# EAGLE design freq_count_rpi_hat (EAGLE 9.5.1)
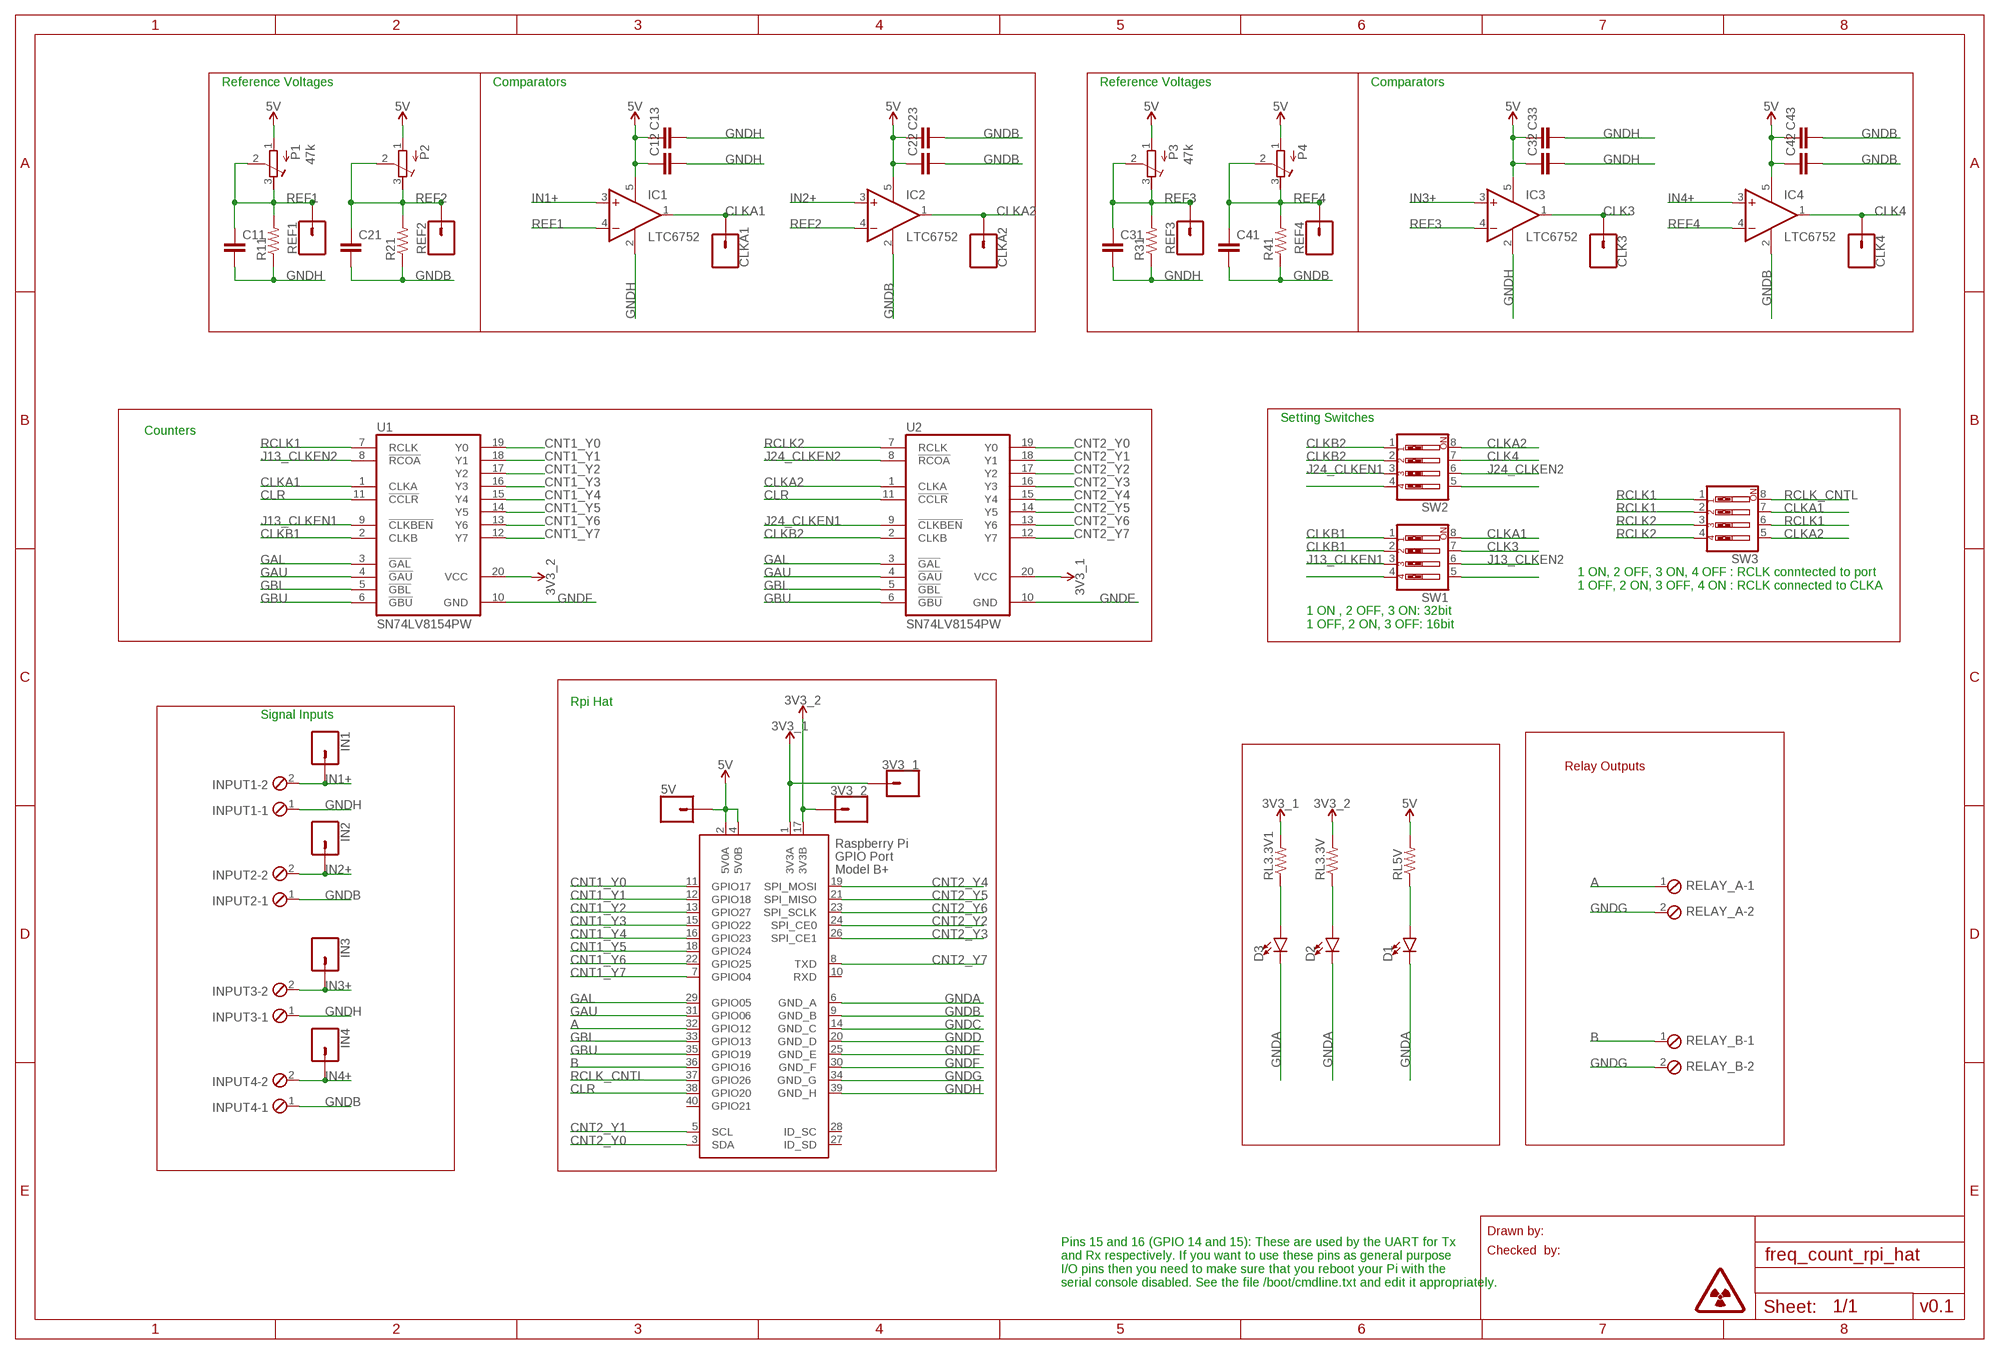
[diagram p0: schematic, sheet 1]

## Parts
3V3_1  CONN_01  [1X01]
3V3_2  CONN_01  [1X01]
5V  CONN_01  [1X01]
C11  C-EUC1206  [C1206]
C12  C-EUC1206  [C1206]
C13  C-EUC1206  [C1206]
C21  C-EUC1206  [C1206]
C22  C-EUC1206  [C1206]
C23  C-EUC1206  [C1206]
C31  C-EUC1206  [C1206]
C32  C-EUC1206  [C1206]
C33  C-EUC1206  [C1206]
C41  C-EUC1206  [C1206]
C42  C-EUC1206  [C1206]
C43  C-EUC1206  [C1206]
CLK3  CONN_01  [1X01]
CLK4  CONN_01  [1X01]
CLKA1  CONN_01  [1X01]
CLKA2  CONN_01  [1X01]
D1  LED1206  [LED-1206]
D2  LED1206  [LED-1206]
D3  LED1206  [LED-1206]
IC1  LTC6752  OPA344N-SOT23  [SOT23-5]
IC2  LTC6752  OPA344N-SOT23  [SOT23-5]
IC3  LTC6752  OPA344N-SOT23  [SOT23-5]
IC4  LTC6752  OPA344N-SOT23  [SOT23-5]
IN1  CONN_01  [1X01]
IN2  CONN_01  [1X01]
IN3  CONN_01  [1X01]
IN4  CONN_01  [1X01]
INPUT1  MPT2  [2POL254]
INPUT2  MPT2  [2POL254]
INPUT3  MPT2  [2POL254]
INPUT4  MPT2  [2POL254]
P1  47k  R-TRIMM3296W  [RTRIM3296W]
P2  R-TRIMM3296W  [RTRIM3296W]
P3  47k  R-TRIMM3296W  [RTRIM3296W]
P4  R-TRIMM3296W  [RTRIM3296W]
R11  R-US_R1206  [R1206]
R21  R-US_R1206  [R1206]
R31  R-US_R1206  [R1206]
R41  R-US_R1206  [R1206]
REF1  CONN_01  [1X01]
REF2  CONN_01  [1X01]
REF3  CONN_01  [1X01]
REF4  CONN_01  [1X01]
RELAY_A  MPT2  [2POL254]
RELAY_B  MPT2  [2POL254]
RL3.3V  R-US_R1206  [R1206]
RL3.3V1  R-US_R1206  [R1206]
RL5V  R-US_R1206  [R1206]
SW1  SW_DIP-4  [EDG-04]
SW2  SW_DIP-4  [EDG-04]
SW3  SW_DIP-4  [EDG-04]
U1  SN74LV8154PW  [TSSOP20]
U2  SN74LV8154PW  [TSSOP20]
X1  RASPI_BOARD_B+#_H  [RASPI_BOARD_B+HAT]

## Nets
5V: 5V.1 C12.1 C13.1 C22.1 C23.1 C32.1 C33.1 C42.1 C43.1 IC1.5(V+) IC2.5(V+) IC3.5(V+) IC4.5(V+) P1.1(A) P2.1(A) P3.1(A) P4.1(A) RL5V.2 X1.2(5V0A) X1.4(5V0B)
A: RELAY_A.1 X1.32(GPIO12)
B: RELAY_B.1 X1.36(GPIO16)
CLK3: CLK3.1 IC3.1(OUT) SW1.7
CLK4: CLK4.1 IC4.1(OUT) SW2.7
CLKA1: CLKA1.1 IC1.1(OUT) SW1.8 SW3.7 U1.1(CLKA)
CLKA2: CLKA2.1 IC2.1(OUT) SW2.8 SW3.5 U2.1(CLKA)
CLKB1: SW1.1 SW1.2 U1.2(CLKB)
CLKB2: SW2.1 SW2.2 U2.2(CLKB)
CLR: U1.11(!CCLR!) U2.11(!CCLR!) X1.38(GPIO20)
CNT1_Y0: U1.19(Y0) X1.11(GPIO17)
CNT1_Y1: U1.18(Y1) X1.12(GPIO18)
CNT1_Y2: U1.17(Y2) X1.13(GPIO27)
CNT1_Y3: U1.16(Y3) X1.15(GPIO22)
CNT1_Y4: U1.15(Y4) X1.16(GPIO23)
CNT1_Y5: U1.14(Y5) X1.18(GPIO24)
CNT1_Y6: U1.13(Y6) X1.22(GPIO25)
CNT1_Y7: U1.12(Y7) X1.7(GPIO04)
CNT2_Y0: U2.19(Y0) X1.3(SDA)
CNT2_Y1: U2.18(Y1) X1.5(SCL)
CNT2_Y2: U2.17(Y2) X1.24(SPI_CE0)
CNT2_Y3: U2.16(Y3) X1.26(SPI_CE1)
CNT2_Y4: U2.15(Y4) X1.19(SPI_MOSI)
CNT2_Y5: U2.14(Y5) X1.21(SPI_MISO)
CNT2_Y6: U2.13(Y6) X1.23(SPI_SCLK)
CNT2_Y7: U2.12(Y7) X1.8(TXD)
GAL: U1.3(!GAL!) U2.3(!GAL!) X1.29(GPIO05)
GAU: U1.4(!GAU!) U2.4(!GAU!) X1.31(GPIO06)
GBL: U1.5(!GBL!) U2.5(!GBL!) X1.33(GPIO13)
GBU: U1.6(!GBU!) U2.6(!GBU!) X1.35(GPIO19)
GNDA: D1.C D2.C D3.C X1.6(GND_A)
GNDB: C21.2 C22.2 C23.2 C41.2 C42.2 C43.2 IC2.2(V-) IC4.2(V-) INPUT2.1 INPUT4.1 R21.1 R41.1 X1.9(GND_B)
GNDC: X1.14(GND_C)
GNDD: X1.20(GND_D)
GNDE: U2.10(GND) X1.25(GND_E)
GNDF: U1.10(GND) X1.30(GND_F)
GNDG: RELAY_A.2 RELAY_B.2 X1.34(GND_G)
GNDH: C11.2 C12.2 C13.2 C31.2 C32.2 C33.2 IC1.2(V-) IC3.2(V-) INPUT1.1 INPUT3.1 R11.1 R31.1 X1.39(GND_H)
IN1+: IC1.3(+IN) IN1.1 INPUT1.2
IN2+: IC2.3(+IN) IN2.1 INPUT2.2
IN3+: IC3.3(+IN) IN3.1 INPUT3.2
IN4+: IC4.3(+IN) IN4.1 INPUT4.2
J13_CLKEN1: SW1.3 U1.9(!CLKBEN!)
J13_CLKEN2: SW1.6 U1.8(!RCOA!)
J24_CLKEN1: SW2.3 U2.9(!CLKBEN!)
J24_CLKEN2: SW2.6 U2.8(!RCOA!)
N$1: D1.A RL5V.1
N$2: D2.A RL3.3V.1
N$3: D3.A RL3.3V1.1
N$4: SW1.4
N$5: SW2.4
N$9: SW2.5
N$11: SW1.5
RCLK1: SW3.1 SW3.2 SW3.6 U1.7(RCLK)
RCLK2: SW3.3 SW3.4 U2.7(RCLK)
RCLK_CNTL: SW3.8 X1.37(GPIO26)
REF1: C11.1 IC1.4(-IN) P1.2(S) P1.3(E) R11.2 REF1.1
REF2: C21.1 IC2.4(-IN) P2.2(S) P2.3(E) R21.2 REF2.1
REF3: C31.1 IC3.4(-IN) P3.2(S) P3.3(E) R31.2 REF3.1
REF4: C41.1 IC4.4(-IN) P4.2(S) P4.3(E) R41.2 REF4.1
VCC_1: 3V3_1.1 RL3.3V1.2 U2.20(VCC) X1.1(3V3A) ; supply symbol labelled 3V3_1
VCC_2: 3V3_2.1 RL3.3V.2 U1.20(VCC) X1.17(3V3B) ; supply symbol labelled 3V3_2
Unconnected: X1.10(RXD) X1.27(ID_SD) X1.28(ID_SC) X1.40(GPIO21)

## Notes on the sheet
- Reference Voltages | Comparators | Reference Voltages | Comparators
- Setting Switches
- Counters
- 1 ON, 2 OFF, 3 ON, 4 OFF : RCLK conntected to port
  1 OFF, 2 ON, 3 OFF, 4 ON : RCLK connected to CLKA
- 1 ON , 2 OFF, 3 ON: 32bit
  1 OFF, 2 ON, 3 OFF: 16bit
- Rpi Hat
- Signal Inputs
- Relay Outputs
- Drawn by:
- Checked  by:
- Pins 15 and 16 (GPIO 14 and 15): These are used by the UART for Tx
  and Rx respectively. If you want to use these pins as general purpose
  I/O pins then you need to make sure that you reboot your Pi with the
  serial console disabled. See the file /boot/cmdline.txt and edit it appropriately.
- v0.1

## Library data of the parts
3V3_1 3V3_2 5V CLK3 CLK4 CLKA1 CLKA2 IN1-IN4 REF1-REF4 = SparkFun-Connectors:CONN_01: Single connection point. Often used as Generic Header-pin footprint for 0.1 inch spaced/style header connections On any of the 0.1 inch spaced packages, you can populate with these: Break Away Headers - Straight <https://www.sparkfun.com/products/116> (PRT-00116) Break Away Male Headers - Right Angle <https://www.sparkfun.com/products/553> (PRT-00553) Female Headers <https://www.sparkfun.com/products/115> (PRT-00115) Break Away Headers - Machine Pin <https://www.sparkfun.com/products/117> (PRT-00117) Break Away Female Headers - Swiss Machine Pin <https://www.sparkfun.com/products/743> (PRT-00743) This device is also useful as a general connection point to wire up your design to another part of your project. Our various solder wires solder well into these plated through hole pads. Hook-Up Wire - Assortment (Stranded, 22 AWG) <https://www.sparkfun.com/products/11375> (PRT-11375) Hook-Up Wire - Assortment (Solid Core, 22 AWG) <https://www.sparkfun.com/products/11367> (PRT-11367) View the entire wire category on our website here <https://www.sparkfun.com/categories/141> Special notes: SMTSO-256-ET is a "flush mount" nut for a 4-40 screw. We mostly use this on specialty testbeds; it is a nice way to connect hardware to your PCB at an adjustable hieght. Also note, the SNAP packages are for using a snappable style connector. We sell a baggie of snaps and they are also used on two LilyPad designs: Snap Assortment - 30 pack (male and female) <https://www.sparkfun.com/products/11347> (DEV-11347) LilyPad Arduino SimpleSnap <https://www.sparkfun.com/products/10941> (DEV-10941) LilyPad SimpleSnap Protoboard <https://www.sparkfun.com/products/10940> (DEV-10940)
C11-C13 C21-C23 C31-C33 C41-C43 = resistor:C-EU: CAPACITOR, European symbol
D1-D3 = SparkFun-LED:LED: LED (Generic) Standard schematic elements and footprints for 5mm, 3mm, 1206, and 0603 sized LEDs. Generic LEDs with no color specified.
IC1-IC4 = linear:OPA*-SOT23: Single Operational Amplifier Low Power, Single-Supply, Rail-To-Rail Operational Amplifier Source: http://focus.ti.com/lit/ds/symlink/opa2345.pdf
INPUT1-INPUT4 RELAY_A RELAY_B = con-phoenix-254:MPT2: PHOENIX CONNECTOR; OC_FARNELL: unknown; OC_NEWARK: unknown
P1-P4 = rcl:R-TRIMM: Trimm resistor; SPICEMODEL: X; SPICEPREFIXL: POT
R11 R21 R31 R41 RL3.3V RL3.3V1 RL5V = resistor:R-US_: RESISTOR, American symbol
SW1-SW3 = special:SW_DIP-4: DIP SWITCH
U1 U2 = 74LV:SN74LV8154: DUAL 16 BIT BINARY COUNTER
X1 = raspberrypi_bastelstube_v13:RASPI_BOARD_B+#: Raspberry Pi GPIO connector with markings for the outer dimensions of the Raspberry Pi board model B+ with different sets of drill holes or mounting pads All pins connected

## Board
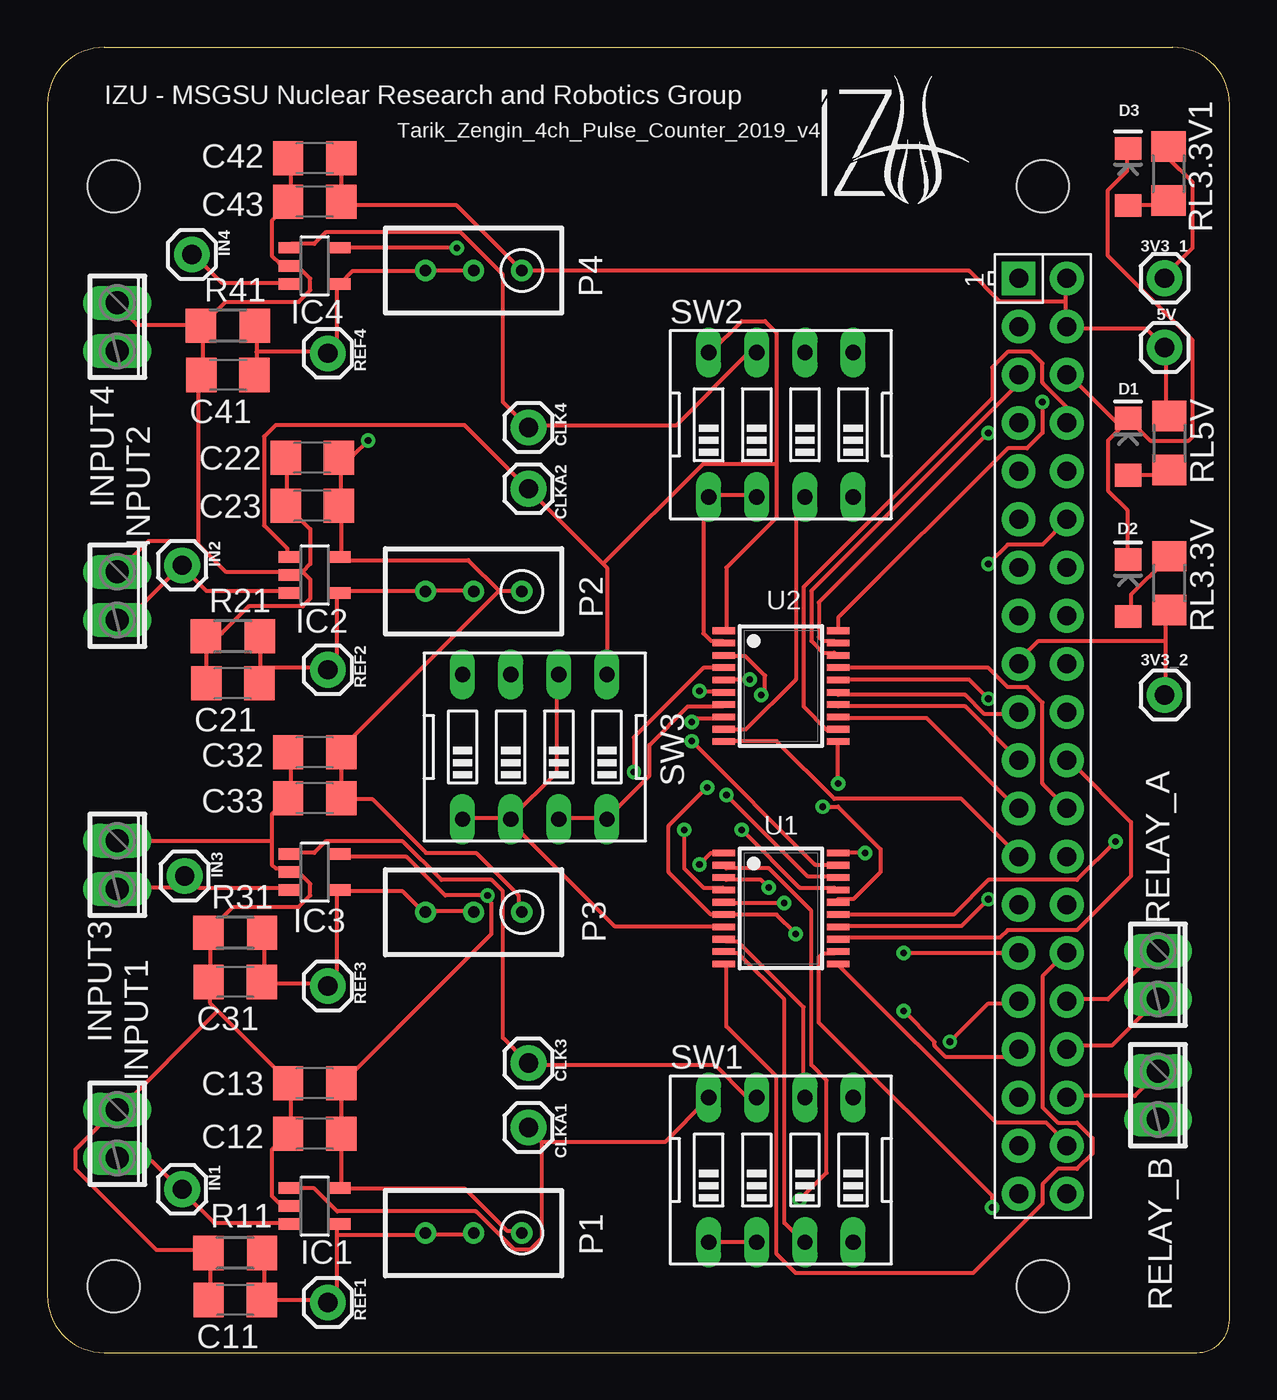
[diagram p1: board, top side]
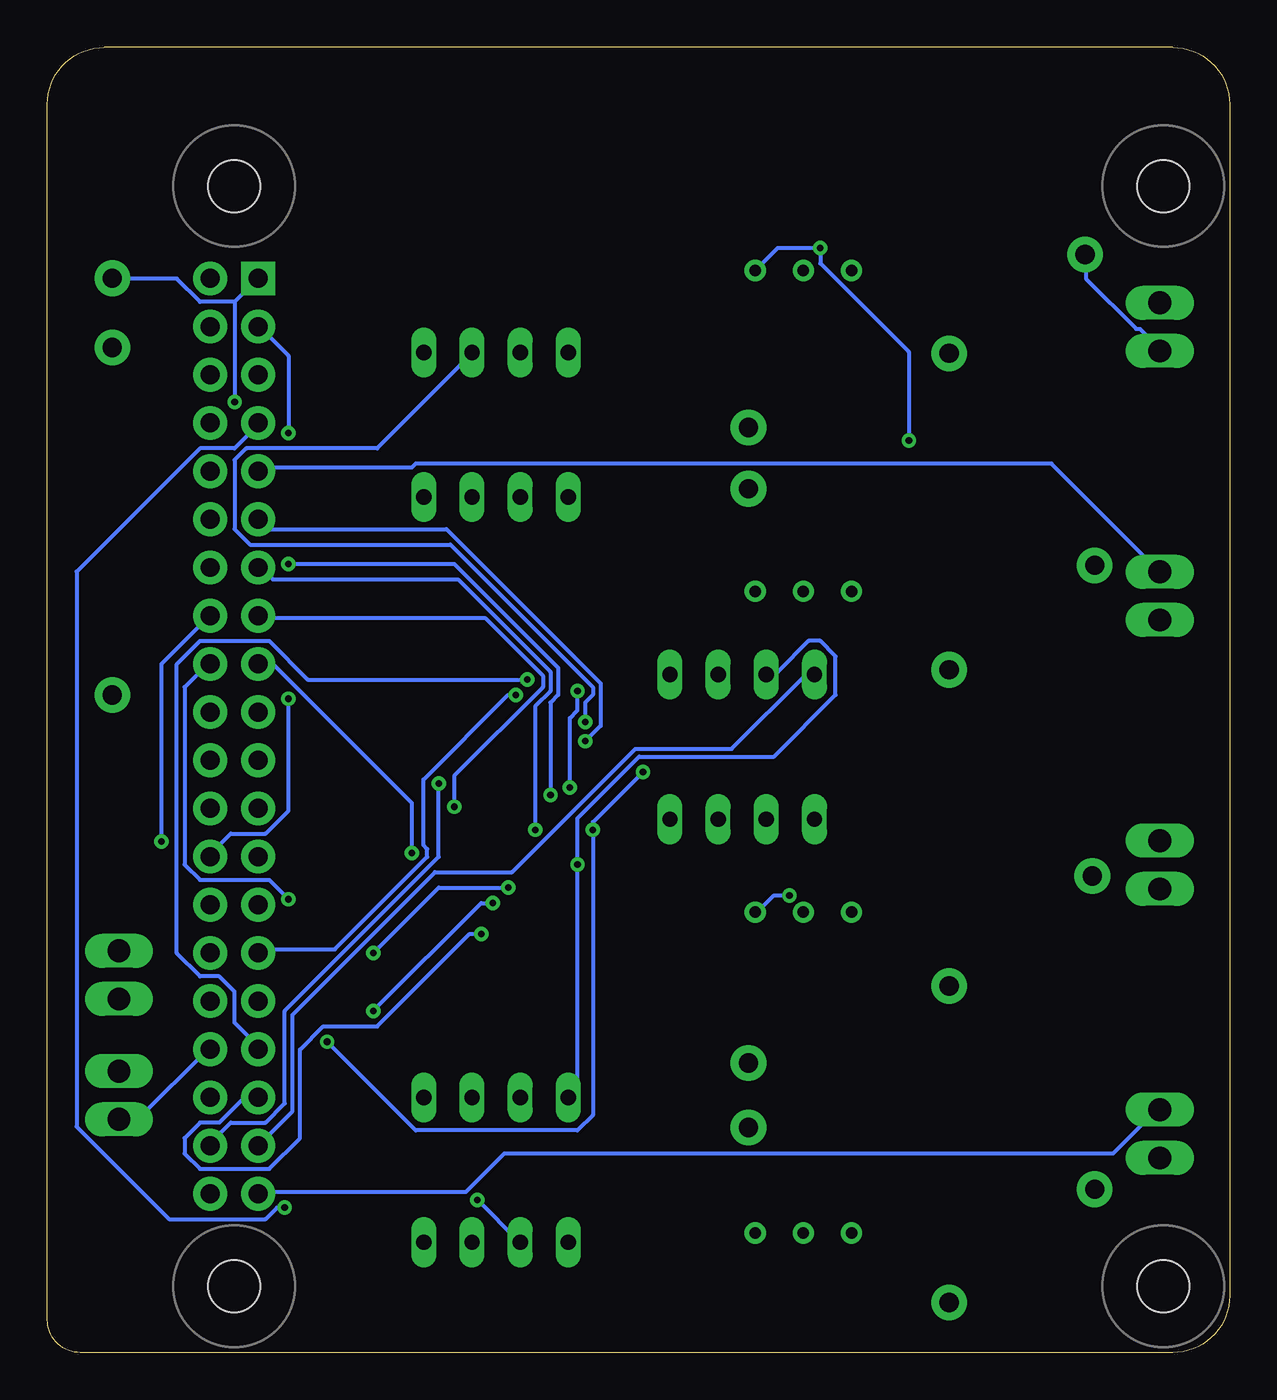
[diagram p2: board, bottom side, seen from below]

Size 62.35 x 68.81 mm. Coordinates in mm from the lower left corner, seen from the top.
Copper layers (1*16): Top 0.035mm / dielectric 1.5mm / Bottom 0.035mm
Design rules "default *": minimum track width 8mil, minimum drill 0.35mm, track to track 8mil, track to pad 8mil, pad to pad 8mil, via to via 8mil, smd to smd 6mil, copper to edge 40mil, drill to drill 8mil, minimum pad ring 10mil, minimum via ring 8mil, stop-mask expansion 4mil, vias tented up to drill 0mil, thermal gap 10mil

### Footprints (pad centres in the part's own frame; a part is rotated, then mirrored left to right if it is on the bottom)
1X01 = drill 1.016 pad 1.88: 1 0,0
C1206 = smd 1.6 x 1.8: 1 -1.4,0; 2 1.4,0
LED-1206 = smd 1.2 x 1.4: A -1.5,0; C 1.5,0
SOT23-5 = smd 0.6 x 1.2: 1 -0.95,-1.306; 2 0,-1.306; 3 0.95,-1.306; 4 0.95,1.306; 5 -0.95,1.306
2POL254 = drill 1.2 long: 1 -1.27,0; 2 1.27,0
RTRIM3296W = drill 0.61: 1 0,-2.54; 2 0,0; 3 0,2.54
R1206 = smd 1.6 x 1.803: 1 -1.422,0; 2 1.422,0
EDG-04 = drill 0.813 long: 1 -3.81,-3.81; 2 -1.27,-3.81; 3 1.27,-3.81; 4 3.81,-3.81; 5 3.81,3.81; 6 1.27,3.81; 7 -1.27,3.81; 8 -3.81,3.81
TSSOP20 = smd 0.35 x 1.2: 1 -2.925,-3.018; 2 -2.275,-3.018; 3 -1.625,-3.018; 4 -0.975,-3.018; 5 -0.325,-3.018; 6 0.325,-3.018; 7 0.975,-3.018; 8 1.625,-3.018; 9 2.275,-3.018; 10 2.925,-3.018; 11 2.925,3.018; 12 2.275,3.018; 13 1.625,3.018; 14 0.975,3.018; 15 0.325,3.018; 16 -0.325,3.018; 17 -0.975,3.018; 18 -1.625,3.018; 19 -2.275,3.018; 20 -2.925,3.018
RASPI_BOARD_B+HAT = drill 1 pad 1.778 square: 1 8.37,51.23 | drill 1 pad 1.778: 2 8.37,53.77; 3 10.91,51.23; 4 10.91,53.77; 5 13.45,51.23; 6 13.45,53.77; 7 15.99,51.23; 8 15.99,53.77; 9 18.53,51.23; 10 18.53,53.77; 11 21.07,51.23; 12 21.07,53.77; 13 23.61,51.23; 14 23.61,53.77; 15 26.15,51.23; 16 26.15,53.77; 17 28.69,51.23; 18 28.69,53.77; 19 31.23,51.23; 20 31.23,53.77; 21 33.77,51.23; 22 33.77,53.77; 23 36.31,51.23; 24 36.31,53.77; 25 38.85,51.23; 26 38.85,53.77; 27 41.39,51.23; 28 41.39,53.77; 29 43.93,51.23; 30 43.93,53.77; 31 46.47,51.23; 32 46.47,53.77; 33 49.01,51.23; 34 49.01,53.77; 35 51.55,51.23; 36 51.55,53.77; 37 54.09,51.23; 38 54.09,53.77; 39 56.63,51.23; 40 56.63,53.77 | hole 2.75: 3.5,3.5; 3.5,52.5; 61.5,3.5; 61.5,52.5

### Placement (x,y rotation side)
3V3_1  58.93,56.64 0 top
3V3_2  58.93,34.67 270 top
5V  58.93,52.99 270 top
C11  9.91,2.77 180 top
C12  14.1,11.53 180 top
C13  14.1,14.2 180 top
C21  9.78,35.28 180 top
C22  13.97,47.18 180 top
C23  13.97,44.64 180 top
C31  9.91,19.53 180 top
C32  14.1,31.64 180 top
C33  14.1,29.23 180 top
C41  9.53,51.54 180 top
C42  14.1,62.97 180 top
C43  14.1,60.68 180 top
CLK3  25.37,15.27 270 top
CLK4  25.37,48.77 270 top
CLKA1  25.37,11.86 270 top
CLKA2  25.37,45.54 270 top
D1  57,47.75 90 top
D2  57,40.31 90 top
D3  57,61.98 90 top
IC1  14.1,7.72 270 top
IC2  14.1,41 270 top
IC3  14.1,25.33 270 top
IC4  14.1,57.3 270 top
IN1  7.11,8.61 270 top
IN2  7.11,41.51 270 top
IN3  7.24,25.12 270 top
IN4  7.62,57.89 270 top
INPUT1  3.68,11.53 270 top
INPUT2  3.68,39.9 270 top
INPUT3  3.68,25.71 270 top
INPUT4  3.68,54.08 270 top
P1  22.48,6.3 90 top
P2  22.48,40.13 90 top
P3  22.48,23.22 90 top
P4  22.48,57.05 90 top
R11  9.91,5.25 0 top
R21  9.78,37.76 0 top
R31  9.91,22.14 0 top
R41  9.53,54.14 0 top
REF1  14.8,2.64 270 top
REF2  14.8,36 270 top
REF3  14.8,19.32 270 top
REF4  14.8,52.68 270 top
RELAY_A  58.57,19.92 270 top
RELAY_B  58.57,13.57 270 top
RL3.3V  59.18,40.57 270 top
RL3.3V1  59.13,62.16 90 top
RL5V  59.18,47.96 90 top
SW1  38.68,9.63 0 top
SW2  38.68,48.92 0 top
SW3  25.7,31.93 0 top
U1  38.68,23.42 270 top
U2  38.68,35.13 270 top
X1  0,65 270 top

### Tracks (layer width: path | path; a pad name or v marks a point on that pad's centre or on a via)
5V  (via drill 0.35)
  Top 0.203: P1.1 24.84,6.43 24.23,6.43 22,8.66 15.49,8.66 IC1.5 15.49,8.87 15.49,11.51 C12.1 15.49,11.71 15.49,14.15 C13.1 15.7,14.35 23.42,22.07 23.42,23.7 23.01,24.11 | 23.01,24.11 20.98,24.11 18.95,26.14 15.49,26.14 IC3.5 | 23.83,40.16 24.84,40.16 P2.1 | 23.83,40.16 22.2,41.78 15.49,41.78 IC2.5 15.49,41.99 15.49,44.63 C23.1 15.49,44.83 15.49,47.07 C22.1 15.49,47.27 16.1,47.27 v16.92,48.08 | P3.1 24.84,23.29 24.84,24.11 22.61,26.34 19.96,26.34 17.12,29.19 15.7,29.19 C33.1 15.49,29.39 15.49,31.62 C32.1 15.49,31.83 23.83,40.16 | v23.22,24.11 23.01,24.11 | C42.1 15.49,62.92 C43.1 15.7,60.48 21.59,60.48 24.84,57.23 P4.1 25.04,57.02 48.62,57.02 50.24,55.4 53.7,55.4 | v21.59,58.24 15.49,58.24 IC4.5 | 53.7,55.4 53.7,56.62 X1.2 | 53.7,55.4 53.7,54.18 X1.4 53.9,53.98 57.96,53.98 58.78,53.16 5V.1 58.98,52.96 58.98,49.51 RL5V.2
  Bottom 0.203: v23.22,24.11 24.03,24.11 24.84,23.29 P3.1 | P4.1 24.84,57.23 23.83,58.24 v21.59,58.24 21.59,57.43 16.92,52.76 v16.92,48.08
A
  Top 0.203: X1.32 53.9,18.62 55.93,18.62 58.57,21.26 RELAY_A.1
B
  Top 0.203: X1.36 53.9,13.54 57.35,13.54 58.57,14.76 RELAY_B.1
CLK3
  Top 0.203: IC3.1 12.85,26.34 14.07,26.34 14.68,26.95 18.75,26.95 20.78,24.92 23.42,24.92 24.03,24.31 24.03,16.59 25.25,15.37 CLK3.1 25.45,15.16 35.2,15.16 36.83,13.54 37.24,13.54 SW1.7
CLK4
  Top 0.203: IC4.1 12.85,58.45 14.07,58.45 14.68,59.06 21.79,59.06 24.03,56.82 24.03,50.12 CLK4.1 25.45,48.9 33.17,48.9 36.83,52.55 37.24,52.55 SW2.7
CLKA1  (via drill 0.35)
  Top 0.203: 26.06,11.1 26.06,6.02 25.45,5.41 24.64,5.41 22.61,7.44 15.29,7.44 14.07,8.66 12.85,8.66 IC1.1 | 26.06,11.1 25.45,11.71 CLKA1.1 | v34.39,25.73 35,26.34 35.61,26.34 U1.1 | 26.06,11.1 32.56,11.1 34.8,13.34 SW1.8
  Bottom 0.203: SW1.8 34.8,13.54 34.39,13.95 v34.39,25.73 34.39,28.17 31.14,31.42 24.03,31.42 20.78,34.67 20.78,36.7 21.59,37.52 22.2,37.52 23.83,35.89 24.43,35.89 SW3.7
CLKA2
  Top 0.203: 38.46,46.86 38.46,53.77 37.85,54.38 36.63,54.38 35,52.76 SW2.8 | 38.46,46.86 38.46,44.02 35.81,41.38 35.81,38.13 U2.1 | IC2.1 12.65,41.99 12.65,42.39 11.43,43.61 11.43,48.29 12.04,48.9 22,48.9 25.25,45.64 CLKA2.1 25.45,45.44 29.31,41.58 | SW3.5 29.51,41.38 29.31,41.58 | 38.46,46.86 34.59,46.86 29.31,41.58
CLKB1  (via drill 0.35)
  Top 0.203: v39.67,8.05 41.1,9.48 41.1,14.35 40.28,15.16 40.28,23.29 38.05,25.53 35.81,25.53 U1.2 | SW1.2 SW1.1
  Bottom 0.203: v39.67,8.05 37.44,5.82 SW1.2
CLKB2
  Top 0.203: U2.2 35.61,37.52 35,37.52 34.59,37.92 34.59,44.83 SW2.1 35,45.24 37.24,45.24 SW2.2
CLR  (via drill 0.35)
  Top 0.203: U1.11 41.71,20.45 50.04,12.12 52.68,12.12 53.7,11.1 X1.38 | v41.71,30 41.71,32.23 U2.11
  Bottom 0.203: v41.71,30 41.71,26.14 49.83,18.01 49.83,13.13 50.85,12.12 52.68,12.12 53.7,11.1 X1.38
CNT1_Y0  (via drill 0.35)
  Top 0.203: v33.99,32.23 40.49,25.73 41.5,25.73 U1.19
  Bottom 0.203: v33.99,32.23 33.17,33.05 33.17,35.28 41.3,43.41 50.65,43.41 51.05,43.82 X1.11
CNT1_Y1  (via drill 0.35)
  Top 0.203: v35.81,29.39 40.08,25.12 41.5,25.12 U1.18 | v49.63,41.58 50.65,42.6 52.48,42.6 53.7,43.82 X1.12
  Bottom 0.203: v35.81,29.39 35.81,34.27 35.41,34.67 35.41,36.09 40.89,41.58 v49.63,41.58
CNT1_Y2  (via drill 0.35)
  Top 0.203: v36.63,27.56 39.67,24.51 41.5,24.51 U1.17
  Bottom 0.203: v36.63,27.56 36.63,34.06 35.81,34.88 35.81,35.89 40.69,40.77 50.44,40.77 51.05,41.38 X1.13
CNT1_Y3  (via drill 0.35)
  Top 0.203: v40.89,28.78 41.71,28.78 43.94,26.54 43.94,25.32 42.52,23.9 41.71,23.9 U1.16
  Bottom 0.203: v40.89,28.78 40.89,30.4 36.22,35.08 36.22,35.69 39.27,38.74 51.05,38.74 X1.15
CNT1_Y4  (via drill 0.35)
  Top 0.203: v56.34,26.95 54.31,24.92 49.63,24.92 47.8,23.09 U1.15
  Bottom 0.203: v56.34,26.95 56.34,36.3 53.9,38.74 X1.16
CNT1_Y5  (via drill 0.35)
  Top 0.203: v49.63,23.9 48.21,22.48 41.71,22.48 U1.14
  Bottom 0.203: v49.63,23.9 50.65,24.92 54.31,24.92 55.12,25.73 55.12,35.08 53.9,36.3 X1.18
CNT1_Y6
  Top 0.203: U1.13 41.71,21.87 50.24,21.87 50.65,22.28 54.31,22.28 57.15,25.12 57.15,27.97 53.9,31.22 X1.22
CNT1_Y7  (via drill 0.35)
  Top 0.203: v49.83,7.65 49.83,8.26 40.69,17.4 40.69,20.85 40.89,21.06 41.5,21.06 U1.12
  Bottom 0.203: v49.83,7.65 50.24,7.65 50.85,7.04 55.93,7.04 60.81,11.91 60.81,41.17 54.31,47.68 52.48,47.68 51.26,48.9 X1.7
CNT2_Y0  (via drill 0.35)
  Top 0.203: v49.63,48.49 40.69,39.55 40.69,37.72 40.89,37.52 41.5,37.52 U2.19
  Bottom 0.203: v49.63,48.49 49.63,52.55 51.05,53.98 X1.3
CNT2_Y1
  Top 0.203: U2.18 41.5,36.91 40.89,36.91 40.28,37.52 40.28,40.16 51.05,50.93 51.05,51.54 X1.5
CNT2_Y2
  Top 0.203: U2.17 49.63,36.09 50.65,35.08 51.66,35.08 52.48,34.27 52.48,30 53.7,28.78 X1.24
CNT2_Y3  (via drill 0.35)
  Top 0.203: v49.63,34.47 48.62,35.48 41.71,35.48 U2.16
  Bottom 0.203: v49.63,34.47 49.63,28.58 50.85,27.36 52.68,27.36 53.7,26.34 X1.26
CNT2_Y4
  Top 0.203: U2.15 41.71,34.67 48.41,34.67 49.43,33.66 51.05,33.66 X1.19
CNT2_Y5
  Top 0.203: U2.14 41.71,34.06 48.41,34.06 51.05,31.42 X1.21
CNT2_Y6
  Top 0.203: U2.13 41.71,33.45 46.38,33.45 51.05,28.78 X1.23
CNT2_Y7
  Top 0.203: U2.12 41.5,32.84 41.1,32.84 39.88,34.06 39.88,40.36 49.83,50.32 49.83,51.94 50.65,52.76 51.87,52.76 52.48,52.15 52.48,51.13 53.7,49.91 53.7,49.1 X1.8
GAL  (via drill 0.35)
  Top 0.203: v38.05,24.51 37.64,24.92 35.81,24.92 U1.3 | v45.16,21.06 51.05,21.06 X1.29 | v37.64,34.67 37.85,34.88 37.85,35.69 36.83,36.7 35.81,36.7 U2.3
  Bottom 0.203: v38.05,24.51 41.71,24.51 v45.16,21.06 | v37.64,34.67 38.05,34.67 42.52,30.2 42.52,26.75 42.32,26.54 42.32,26.14 47.19,21.26 51.05,21.26 X1.29
GAU  (via drill 0.35)
  Top 0.203: v33.58,27.56 33.58,25.53 34.59,24.51 35.61,24.51 U1.4 | v30.94,30.61 30.94,32.44 34.59,36.09 35.61,36.09 U2.4 | v47.6,16.38 49.63,18.42 51.05,18.42 X1.31
  Bottom 0.203: v30.94,30.61 33.58,27.97 v33.58,27.56 33.58,12.52 34.39,11.71 42.93,11.71 v47.6,16.38
GBL  (via drill 0.35)
  Top 0.203: v38.86,23.7 35.81,23.7 U1.5 | v45.16,18.01 46.79,16.38 46.79,16.18 47.4,15.57 50.65,15.57 51.05,15.98 X1.33 | v37.03,35.48 35.81,35.48 U2.5
  Bottom 0.203: v38.86,23.7 39.47,23.7 v45.16,18.01 | v37.03,35.48 48.62,35.48 50.65,37.52 54.31,37.52 55.52,36.3 55.52,21.06 54.31,19.84 53.29,19.84 52.48,19.03 52.48,17.4 51.26,16.18 X1.33
GBU  (via drill 0.35)
  Top 0.203: v39.47,22.07 38.46,23.09 35.81,23.09 U1.6 35.61,23.09 35,23.09 32.77,25.32 32.77,27.76 v34.8,29.8 | v34.39,34.88 35.61,34.88 U2.6
  Bottom 0.203: v39.47,22.07 40.08,22.07 44.96,17.2 47.8,17.2 49.02,15.98 49.02,11.3 50.65,9.68 54.31,9.68 55.12,10.49 55.12,11.3 54.31,12.12 53.29,12.12 52.07,13.34 51.26,13.34 X1.35 | v34.39,34.88 34.39,33.86 34.8,33.45 v34.8,29.8
GNDA
  Top 0.203: 56.74,48.9 56.95,49.1 D1.C | 56.74,48.9 55.93,48.08 55.93,45.44 56.95,44.43 56.95,41.99 D2.C | D3.C 56.95,63.32 56.95,62.31 55.93,61.29 55.93,57.84 60.4,53.37 60.4,48.29 60.2,48.08 58.17,48.08 57.15,49.1 D1.C | 56.74,48.9 56.54,48.9 53.9,51.54 X1.6 | 56.74,48.9 D1.C
GNDB
  Top 0.203: C42.2 12.85,62.92 12.85,60.68 C43.2 12.65,60.48 11.84,59.67 11.84,57.84 12.24,57.43 12.65,57.43 IC4.2 12.85,57.23 13.26,57.23 13.87,56.62 13.87,56.01 13.26,55.4 9.4,55.4 8.18,54.18 R41.1 | R41.1 8.18,53.98 8.18,51.54 C41.2 7.98,51.54 7.98,42.6 | R41.1 7.98,54.18 4.72,54.18 3.71,55.2 INPUT4.1 | C21.2 8.38,37.72 R21.1 8.38,37.92 9.19,37.92 10.62,39.35 13.46,39.35 13.87,39.75 13.87,40.77 13.46,41.17 | 13.46,41.17 12.85,41.17 IC2.2 12.65,41.17 9.4,41.17 7.98,42.6 | 13.46,41.17 13.87,41.58 13.87,43.41 12.65,44.63 C23.2 12.65,44.83 12.65,47.07 C22.2 | 7.98,42.6 7.77,42.8 5.33,42.8 3.71,41.17 INPUT2.1
  Bottom 0.203: X1.9 51.05,46.66 43.13,46.66 42.93,46.86 9.4,46.86 3.71,41.17 INPUT2.1
GNDE
  Top 0.203: U2.10 35.81,32.23 38.46,32.23 41.5,29.19 48.21,29.19 51.05,26.34 X1.25
GNDF
  Top 0.203: U1.10 35.81,20.45 35.81,17.2 38.46,14.56 38.46,5.21 39.47,4.19 48.82,4.19 52.48,7.85 52.48,8.87 53.29,9.68 54.31,9.68 55.12,10.49 55.12,11.3 54.31,12.12 53.29,12.12 52.48,12.93 52.48,19.84 53.7,21.06 X1.30
GNDG
  Top 0.203: X1.34 53.9,16.18 56.13,16.18 58.57,18.62 RELAY_A.2
  Bottom 0.203: RELAY_B.2 58.57,12.32 57.56,12.32 53.9,15.98 X1.34
GNDH
  Top 0.203: 11.84,26.95 11.84,28.37 12.65,29.19 C33.2 12.85,29.39 12.85,31.62 C32.2 | 11.84,26.95 11.84,25.73 12.04,25.53 12.65,25.53 IC3.2 12.85,25.32 13.26,25.32 13.87,24.72 13.87,24.11 13.26,23.5 9.8,23.5 8.59,22.28 R31.1 8.59,22.07 8.59,19.64 C31.2 8.59,19.43 8.59,18.42 8.99,18.01 | 11.84,26.95 3.71,26.95 INPUT3.1 | IC1.2 12.65,7.85 12.24,7.85 11.84,8.26 11.84,10.69 12.65,11.51 C12.2 12.85,11.71 12.85,14.15 C13.2 12.65,14.35 8.99,18.01 | C11.2 8.59,2.77 8.59,5.21 R11.1 8.38,5.41 5.74,5.41 1.47,9.68 1.47,10.69 3.51,12.73 INPUT1.1 3.71,12.73 8.99,18.01
  Bottom 0.203: X1.39 51.05,8.46 40.28,8.46 38.25,10.49 6.15,10.49 3.71,12.93 INPUT1.1
IN1+
  Top 0.203: IC1.3 12.65,6.83 8.79,6.83 7.16,8.46 IN1.1 6.96,8.66 5.54,10.08 3.71,10.08 INPUT1.2
IN2+
  Top 0.203: IC2.3 12.65,40.16 8.38,40.16 7.16,41.38 IN2.1 6.96,41.38 4.32,38.74 3.71,38.74 INPUT2.2
IN3+
  Top 0.203: IC3.3 12.65,24.51 7.98,24.51 7.37,25.12 IN3.1 7.16,25.12 6.55,24.51 3.71,24.51 INPUT3.2
IN4+
  Top 0.203: IC4.3 12.65,56.41 9.19,56.41 7.77,57.84 IN4.1
  Bottom 0.203: INPUT4.2 3.71,52.96 4.72,53.98 4.93,53.98 7.57,56.62 7.57,57.84 IN4.1
J13_CLKEN1
  Top 0.203: U1.9 35.81,21.06 36.42,21.06 38.86,18.62 38.86,6.83 39.88,5.82 SW1.3
J13_CLKEN2
  Top 0.203: U1.8 35.81,21.67 36.42,21.67 39.88,18.21 39.88,13.54 SW1.6
J24_CLKEN1
  Top 0.203: SW2.3 39.47,44.63 39.47,35.48 36.83,32.84 35.81,32.84 U2.9
J24_CLKEN2  (via drill 0.35)
  Top 0.203: v33.99,33.25 34.19,33.45 35.61,33.45 U2.8
  Bottom 0.203: v33.99,33.25 33.99,34.27 33.58,34.67 33.58,35.08 41.1,42.6 51.66,42.6 52.48,43.41 52.48,47.07 51.87,47.68 44.96,47.68 40.08,52.55 SW2.6
N$1
  Top 0.203: D1.A 57.15,46.25 58.78,46.25 58.98,46.46 RL5V.1
N$2
  Top 0.203: D2.A 57.15,38.94 57.15,39.96 58.98,41.78 RL3.3V.1
N$3
  Top 0.203: D3.A 57.15,60.48 58.78,60.48 58.98,60.68 RL3.3V1.1
RCLK1
  Top 0.203: U1.7 35.61,22.48 29.92,22.48 24.43,27.97 SW3.2 24.43,28.17 | 24.43,28.17 22,28.17 SW3.1 | 24.43,28.17 26.87,30.61 26.87,35.69 SW3.6
RCLK2
  Top 0.203: 29.51,28.17 31.75,30.4 31.75,32.03 33.78,34.06 35.61,34.06 U2.7 | 29.51,28.17 27.08,28.17 SW3.3 | 29.51,28.17 SW3.4
RCLK_CNTL
  Bottom 0.203: SW3.8 22,35.69 22.4,35.69 26.26,31.83 31.34,31.83 37.85,25.32 41.91,25.32 49.43,17.81 49.43,12.73 51.05,11.1 X1.37
REF1
  Top 0.203: P1.2 22.4,6.22 19.96,6.22 P1.3 19.76,6.22 15.29,6.22 | 11.43,2.77 11.43,5.21 R11.2 | 15.29,6.22 15.29,3.18 14.88,2.77 REF1.1 14.68,2.77 11.43,2.77 | 15.29,6.22 15.29,6.63 IC1.4 | 11.43,2.77 C11.1
REF2
  Top 0.203: P2.2 22.4,40.16 19.96,40.16 P2.3 19.76,40.16 15.49,40.16 IC2.4 15.29,39.96 15.29,36.5 14.88,36.09 REF2.1 14.68,36.09 11.23,36.09 | 11.23,36.09 11.23,37.72 R21.2 | 11.23,36.09 11.23,35.28 C21.1 11.23,36.09
REF3
  Top 0.203: P3.2 22.4,23.29 19.96,23.29 P3.3 19.76,23.29 18.75,24.31 15.49,24.31 IC3.4 15.29,24.31 15.29,19.84 14.88,19.43 REF3.1 14.68,19.43 11.43,19.43 C31.1 11.43,19.64 11.43,22.07 R31.2
REF4
  Top 0.203: P4.2 22.4,57.02 19.96,57.02 P4.3 19.76,57.02 16.1,57.02 15.49,56.41 IC4.4 15.29,56.21 15.29,53.16 14.88,52.76 REF4.1 14.68,52.76 11.02,52.76 | 11.02,52.76 11.02,53.98 R41.2 | 11.02,52.76 11.02,51.54 C41.1
VCC_1  (via drill 0.35)
  Top 0.203: RL3.3V1.2 59.18,63.53 59.18,62.92 60.4,61.7 60.4,58.24 58.98,56.82 3V3_1.1 | v52.48,50.12 52.48,48.49 51.66,47.68 50.65,47.68 41.71,38.74 41.71,38.13 U2.20
  Bottom 0.203: 52.48,55.4 v52.48,50.12 | 52.48,55.4 51.26,56.62 X1.1 | 52.48,55.4 54.31,55.4 55.52,56.62 58.78,56.62 3V3_1.1
VCC_2  (via drill 0.35)
  Top 0.203: 58.98,37.52 58.98,34.67 3V3_2.1 | 58.98,37.52 58.98,39.14 RL3.3V.2 | v43.13,26.34 U1.20 | 58.98,37.52 52.27,37.52 51.26,36.5 X1.17
  Bottom 0.203: v43.13,26.34 43.13,28.98 50.44,36.3 51.05,36.3 X1.17

### Text on the board
tNames: IZU - MSGSU Nuclear Research and Robotics Group | Tarik_Zengin_4ch_Pulse_Counter_2019_v4 | J13-J24 / short: 32bit / open: 16bit | J1-J2 / 12: 32bit / 23: 16bit